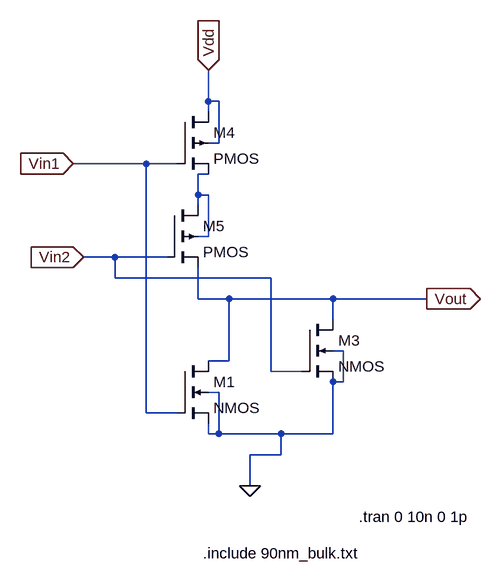
[diagram p0: schematic nor.asc]
nor.asc, the LTspice schematic file:
Version 4
SHEET 1 968 680
WIRE -160 -432 -160 -480
WIRE -144 -432 -160 -432
WIRE -160 -416 -160 -432
WIRE -144 -368 -144 -432
WIRE -144 -368 -160 -368
WIRE -256 -336 -368 -336
WIRE -208 -336 -256 -336
WIRE -160 -320 -176 -320
WIRE -176 -288 -176 -320
WIRE -160 -288 -176 -288
WIRE -176 -272 -176 -288
WIRE -160 -224 -160 -288
WIRE -160 -224 -176 -224
WIRE -304 -192 -352 -192
WIRE -224 -192 -304 -192
WIRE -304 -160 -304 -192
WIRE -64 -160 -304 -160
WIRE -176 -128 -176 -176
WIRE -128 -128 -176 -128
WIRE 32 -128 -128 -128
WIRE 176 -128 32 -128
WIRE 32 -96 32 -128
WIRE 48 -48 32 -48
WIRE -128 -32 -128 -128
WIRE -128 -32 -160 -32
WIRE -64 -16 -64 -160
WIRE -16 -16 -64 -16
WIRE 48 0 48 -48
WIRE 48 0 32 0
WIRE -144 16 -160 16
WIRE -256 48 -256 -336
WIRE -208 48 -256 48
WIRE -160 80 -160 64
WIRE -144 80 -144 16
WIRE -144 80 -160 80
WIRE -48 80 -144 80
WIRE 32 80 32 0
WIRE 32 80 -48 80
WIRE -48 112 -48 80
WIRE -48 112 -96 112
WIRE -96 160 -96 112
FLAG -368 -336 Vin1
IOPIN -368 -336 In
FLAG -352 -192 Vin2
IOPIN -352 -192 In
FLAG -96 160 0
FLAG 176 -128 Vout
IOPIN 176 -128 Out
FLAG -160 -480 Vdd
IOPIN -160 -480 In
SYMBOL nmos4 -208 -32 R0
SYMATTR InstName M1
SYMATTR Value2 l=90n w=200n
SYMBOL nmos4 -16 -96 R0
SYMATTR InstName M3
SYMATTR Value2 l=90n w=200n
SYMBOL pmos4 -208 -416 R0
SYMATTR InstName M4
SYMATTR Value2 l=90n w=400n
SYMBOL pmos4 -224 -272 R0
SYMATTR InstName M5
SYMATTR Value2 l=90n w=400n
TEXT -168 264 Left 2 !.include 90nm_bulk.txt
TEXT 72 208 Left 2 !.tran 0 10n 0 1p

The netlist it stands for:
* nor.asc
M1 Vout Vin1 0 0 NMOS l=90n w=200n
M3 Vout Vin2 0 0 NMOS l=90n w=200n
M4 Vdd Vin1 N001 Vdd PMOS l=90n w=400n
M5 N001 Vin2 Vout N001 PMOS l=90n w=400n
.model NMOS NMOS
.model PMOS PMOS
.lib standard.mos
.include 90nm_bulk.txt
.tran 0 10n 0 1p
.backanno
.end